# Altium project hardware.PrjPcb
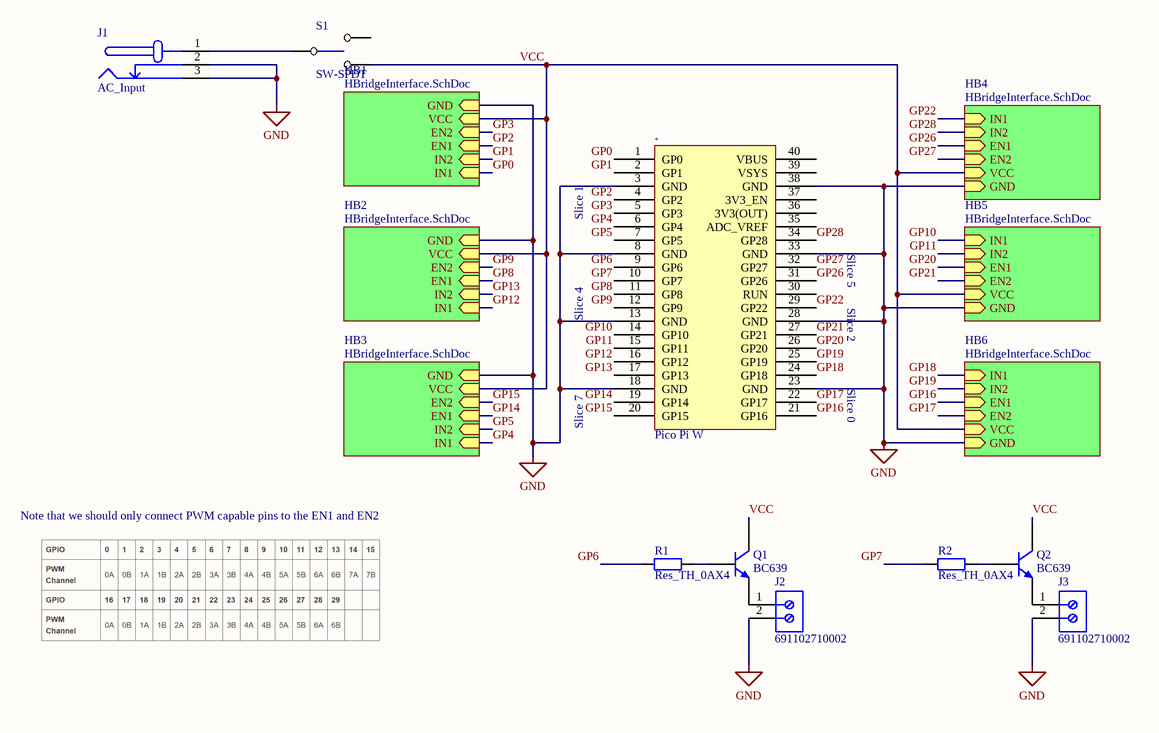
[diagram p0: HardwareSchematic.SchDoc]
3 sheets, 36 parts. Net scope: hierarchical (ports join the sheet entries above them; power ports are global).
Board files: Hardware.PcbDoc, Hardwarev2.PcbDoc
Sheets:
  HardwareSchematic.SchDoc
    HB1 = HBridgeInterface.SchDoc
    HB2 = HBridgeInterface.SchDoc
    HB3 = HBridgeInterface.SchDoc
    HB5 = HBridgeInterface.SchDoc
    HB6 = HBridgeInterface.SchDoc
    HB4 = HBridgeInterface.SchDoc
  HardwareSchematicv2.SchDoc

## Sheet HardwareSchematic.SchDoc
size A4; SheetNumber: 1; SheetTotal: 2

### Parts
(Parts that share a designator on the sheet are numbered #1, #2 ... from top to bottom, then left to right.)
*#1  Pico Pi W  [New footprint 1]
J1  AC_Input  [AC-Socket]
J2  691102710002  [691102710002]
J3  691102710002  [691102710002]
Q1  BC639  [TO-92R]
Q2  BC639  [TO-92R]
R1  Res_TH_0AX4  [AXIAL-0.4]
R2  Res_TH_0AX4  [AXIAL-0.4]
S1  SW-SPDT  [SW-SPDT]

### Sub-sheets
HB1 = HBridgeInterface.SchDoc: IN1 (in), IN2 (in), EN1 (in), EN2 (in), VCC (in), GND (in)
HB2 = HBridgeInterface.SchDoc: IN1 (in), IN2 (in), EN1 (in), EN2 (in), VCC (in), GND (in)
HB3 = HBridgeInterface.SchDoc: IN1 (in), IN2 (in), EN1 (in), EN2 (in), VCC (in), GND (in)
HB4 = HBridgeInterface.SchDoc: IN1 (in), IN2 (in), EN1 (in), EN2 (in), VCC (in), GND (in)
HB5 = HBridgeInterface.SchDoc: IN1 (in), IN2 (in), EN1 (in), EN2 (in), VCC (in), GND (in)
HB6 = HBridgeInterface.SchDoc: IN1 (in), IN2 (in), EN1 (in), EN2 (in), VCC (in), GND (in)

### Nets
GND: *#1.3(GND) *#1.8(GND) *#1.13(GND) *#1.18(GND) *#1.23(GND) *#1.28(GND) *#1.33(GND) *#1.38(GND) J1.2(GND_ALT) J1.3(GND) J2.2 J3.2 ; sheet HB1/GND, sheet HB2/GND, sheet HB3/GND, sheet HB5/GND, sheet HB6/GND, sheet HB4/GND
GP0: *#1.1(GP0) ; sheet HB1/IN1
GP1: *#1.2(GP1) ; sheet HB1/IN2
GP2: *#1.4(GP2) ; sheet HB1/EN1
GP3: *#1.5(GP3) ; sheet HB1/EN2
GP4: *#1.6(GP4) ; sheet HB3/IN1
GP5: *#1.7(GP5) ; sheet HB3/IN2
GP6: *#1.9(GP6) R1.1
GP7: *#1.10(GP7) R2.1
GP8: *#1.11(GP8) ; sheet HB2/EN1
GP9: *#1.12(GP9) ; sheet HB2/EN2
GP10: *#1.14(GP10) ; sheet HB5/IN1
GP11: *#1.15(GP11) ; sheet HB5/IN2
GP12: *#1.16(GP12) ; sheet HB2/IN1
GP13: *#1.17(GP13) ; sheet HB2/IN2
GP14: *#1.19(GP14) ; sheet HB3/EN1
GP15: *#1.20(GP15) ; sheet HB3/EN2
GP16: *#1.21(GP16) ; sheet HB6/EN1
GP17: *#1.22(GP17) ; sheet HB6/EN2
GP18: *#1.24(GP18) ; sheet HB6/IN1
GP19: *#1.25(GP19) ; sheet HB6/IN2
GP20: *#1.26(GP20) ; sheet HB5/EN1
GP21: *#1.27(GP21) ; sheet HB5/EN2
GP22: *#1.29(GP22) ; sheet HB4/IN1
GP26: *#1.31(GP26) ; sheet HB4/EN1
GP27: *#1.32(GP27) ; sheet HB4/EN2
GP28: *#1.34(GP28) ; sheet HB4/IN2
VCC: Q1.2(C) Q2.2(C) S1.3 ; sheet HB1/VCC, sheet HB2/VCC, sheet HB3/VCC, sheet HB5/VCC, sheet HB6/VCC, sheet HB4/VCC
NetJ1_1: J1.1(VCC) S1.2
NetJ2_1: J2.1 Q1.3(E)
NetJ3_1: J3.1 Q2.3(E)
NetQ1_1: Q1.1(B) R1.2
NetQ2_1: Q2.1(B) R2.2

Not connected (* = marked no-connect by the designer): *#1 30(RUN) 35(ADC_VREF) 36(3V3(OUT)) 37(3V3_EN) 39(VSYS) 40(VBUS); S1 1

### Notes on the sheet
- Slice 1
- Slice 5
- Slice 4
- Slice 2
- Slice 7
- Slice 0
- Note that we should only connect PWM capable pins to the EN1 and EN2

### Library data of the parts
*#1 = Pico-Pi-W-1: micro
J1 = CMP-007-000005-1: DC barrel jack connection to AC source; Value: socket; Component Type: Standard; Design Item ID: AC_Input; Source: EE209_SchLib.SchLib; Pin Count: 3
J2 J3 = CMP-1502-03258-2: NexarPartId: 8917706; Number of Levels: 1; Number of Positions Per Level: 2; Current: 15A; Voltage: 300V; Pitch: 5.0038mm; Plating: Steel; Stripping Length: -6mm; Wire Gauge (Min): 14AWG; Wire Gauge (Max): 22AWG; Length: 7.5mm; Contact Material: Brass; Contact Plating: Tin; Packaging: Box; Number of Pins: 2; Voltage Rating: 300V; Termination: Screw; Number of Contacts: 2; Color: Blue; Current Rating: 15A; Mount: Through Hole; Max Operating Temperature: 105°C; Min Operating Temperature: -40°C; REACH SVHC: Unknown; Height: 13.4mm; Width: 11.2mm; Housing Material: Nylon; RoHS: Compliant; Wire/Cable Gauge: 22AWG; Lead Pitch: 5mm
Q1 Q2 = CMP-026-000003-1: High Current Transistor NPN Silicon; PackageDocument: 1996; LatestRevisionDate: 17-Jul-2002; Publisher: Altium Limited; LatestRevisionNote: Re-released for DXP Platform.; Component Type: Standard; Pin Count: 3; PackageReference: 29-04; Source: COMSYS301.SCHLIB; ComponentLink1URL: http://www.motorola.com/; Published: 29-Sep-2000; Design Item ID: BC639; ComponentLink1Description: Manufacturer Link; DatasheetDocument: Nov-1999
R1 R2 = CMP-019-000001-1: Through hole resistor; Source: EE209_SchLib.SchLib; Pin Count: 2; PackageReference: AXIAL-0.4; Design Item ID: Res_TH_0AX4; LatestRevisionDate: 17-Jul-2002; Component Type: Standard; Published: 8-Jun-2000; Value: *; Publisher: Altium Limited; LatestRevisionNote: Re-released for DXP Platform.
S1 = CMP-025-000001-1: Toggle Switch; Source: COMSYS301.SCHLIB; Pin Count: 3; Component Type: Standard; Design Item ID: SW-SPDT

## Sheet HBridgeInterface.SchDoc
size A4; SheetNumber: 2; SheetTotal: 2
Used 6 times, as channels HB1, HB2, HB3, HB5, HB6, HB4. Parts and nets are listed once, with the designators drawn on the sheet.
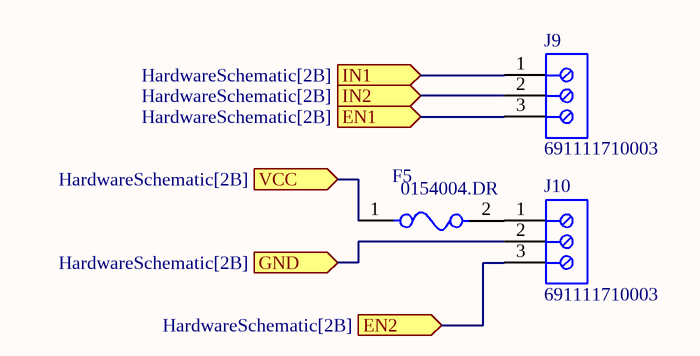
[diagram p1: HBridgeInterface.SchDoc]

### Parts
F5  0154004.DR  [FP-0154-MFG]
J9  691111710003  [691111710003]
J10  691111710003  [691111710003]

### Ports
EN1 (in, see HardwareSchematic[2B]), EN2 (in, see HardwareSchematic[2B]), GND (in, see HardwareSchematic[2B]), IN1 (in, see HardwareSchematic[2B]), IN2 (in, see HardwareSchematic[2B]), VCC (in, see HardwareSchematic[2B])

### Nets
EN1: J9.3 ; port EN1
EN2: J10.3 ; port EN2
GND: J10.2 ; port GND
IN1: J9.1 ; port IN1
IN2: J9.2 ; port IN2
VCC: F5.1 ; port VCC
NetF5_2: F5.2 J10.1

### Channels
HB1: designators end in _HB1; ports EN1=GP2 EN2=GP3 GND=GND IN1=GP0 IN2=GP1 VCC=VCC
HB2: designators end in _HB2; ports EN1=GP8 EN2=GP9 GND=GND IN1=GP12 IN2=GP13 VCC=VCC
HB3: designators end in _HB3; ports EN1=GP14 EN2=GP15 GND=GND IN1=GP4 IN2=GP5 VCC=VCC
HB5: designators end in _HB5; ports EN1=GP20 EN2=GP21 GND=GND IN1=GP10 IN2=GP11 VCC=VCC
HB6: designators end in _HB6; ports EN1=GP16 EN2=GP17 GND=GND IN1=GP18 IN2=GP19 VCC=VCC
HB4: designators end in _HB4; ports EN1=GP26 EN2=GP27 GND=GND IN1=GP22 IN2=GP28 VCC=VCC

### Library data of the parts
F5 = CMP-08605-000003-1: FUSE BRD MNT 4A 125VAC/VDC 2SMD; Manufacturer: Littelfuse; Fuse Blow Speed: Fast; Max Fuse Ac Voltage: 125V; Lead Free: Yes; Device Class L3: unset; Manufacturer Part Number: 0154004.DR; Device Class L2: Fuses; Package: 0154; ComponentLink2Description: Datasheet; Temperature Range Low: -55°C; Temperature Range High: +125°C; Device Class L1: Circuit Protection; Height: 3.81mm; Temperature: -55°C to +125°C; Mouser Description: Surface Mount Fuses Fuseblock w/ fuse 4A OMNI BLOK 154; Automotive: No; Digikey Description: FUSE BRD MNT 4A 125VAC/VDC 2SMD; RoHS: TRUE; Category: Fuse; Fuse Current: 4A; Max Fuse Dc Voltage: 125V; ComponentLink2URL: https://www.littelfuse.com/~/media/electronics/datasheets/fuses/littelfuse_fuse_154_154t_154l_154tl_datasheet.pdf.pdf; Octopart: https://octopart.com/0154004.dr-littelfuse-565861
J9 J10 = CMP-1502-03263-2: NexarPartId: 8917709; Wire/Cable Gauge: 26AWG; Wire Gauge (Min): 14AWG; Plating: Steel; Pitch: 5.0038mm; Current: 8A; Number of Positions Per Level: 3; Number of Levels: 1; Voltage Rating: 300V; Stripping Length: -6mm; Length: 7.6mm; Lead Pitch: 5mm; Color: Green; Termination: Screw; Wire Gauge (Max): 26AWG; Max Operating Temperature: 105°C; RoHS: Compliant; Width: 16.2mm; REACH SVHC: Unknown; Current Rating: 8A; Packaging: Box; Contact Material: Brass; Contact Plating: Tin; Number of Contacts: 3; Voltage: 300V; Height: 14mm; Number of Pins: 3; Mount: Through Hole; Min Operating Temperature: -40°C; Housing Material: Nylon

## Sheet HardwareSchematicv2.SchDoc
size A4; SheetNumber: 3; SheetTotal: 3
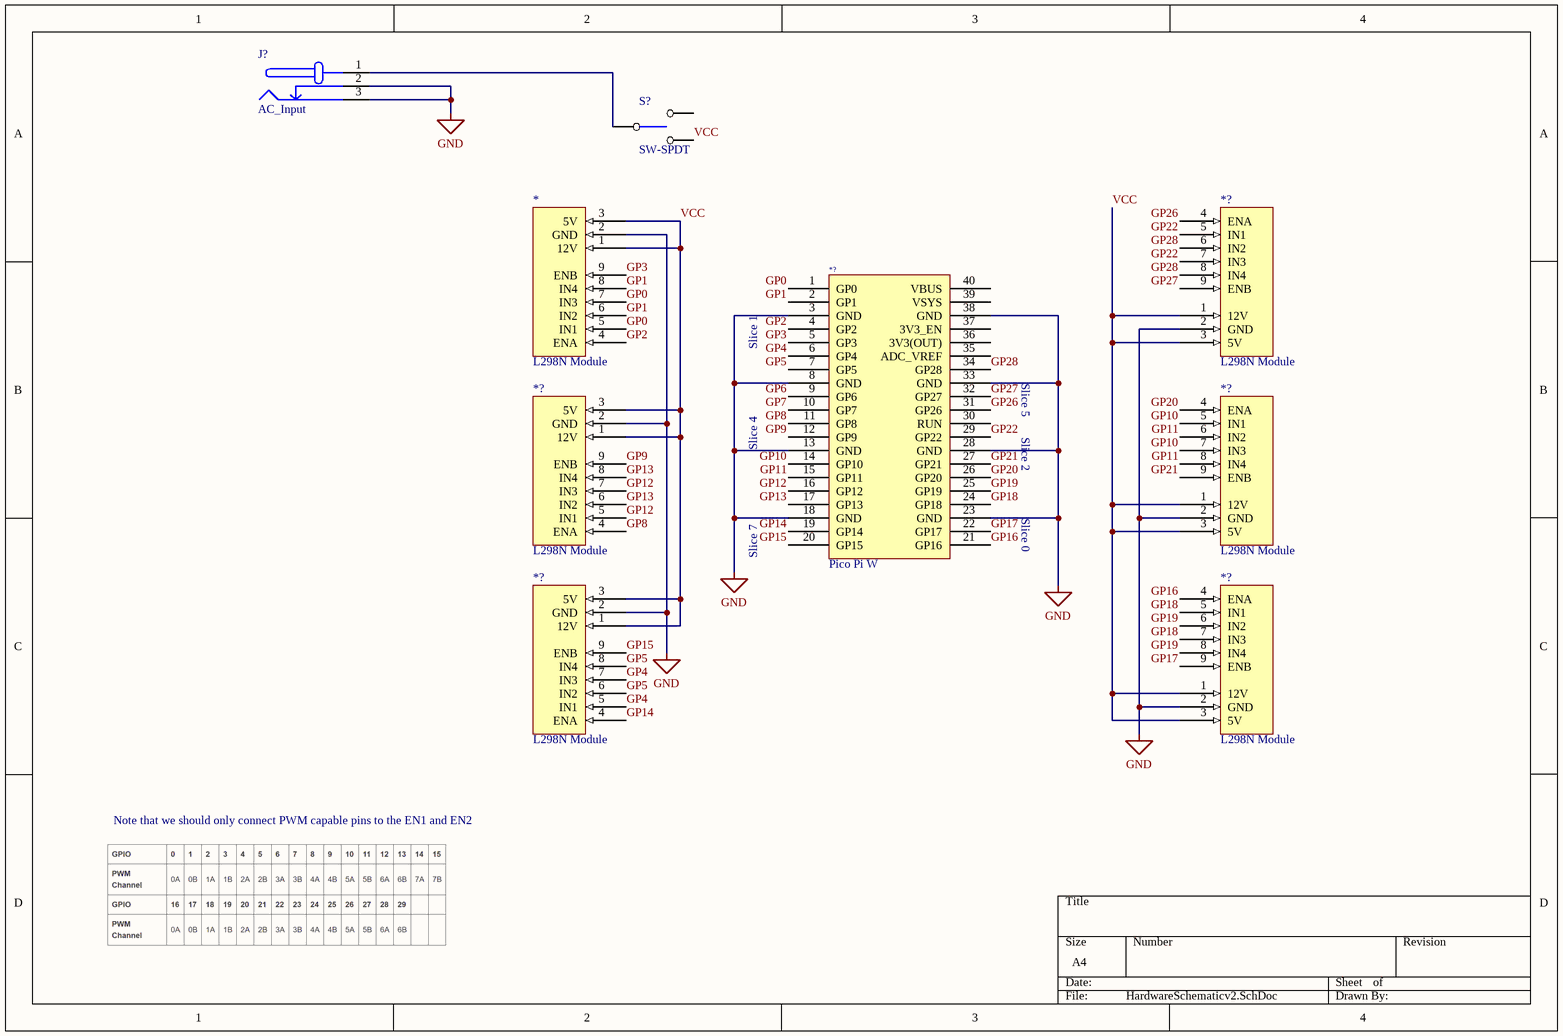
[diagram p2: HardwareSchematicv2.SchDoc]

### Parts
(Parts that share a designator on the sheet are numbered #1, #2 ... from top to bottom, then left to right.)
*#2  L298N Module  [New footprint 1]
*?#1  L298N Module  [New footprint 1]
*?#2  Pico Pi W  [New footprint 1]
*?#3  L298N Module  [New footprint 1]
*?#4  L298N Module  [New footprint 1]
*?#5  L298N Module  [New footprint 1]
*?#6  L298N Module  [New footprint 1]
J?  AC_Input  [AC-Socket]
S?  SW-SPDT  [SW-SPDT]

### Nets
GND: *#2.2(GND) *?#1.2(GND) *?#2.3(GND) *?#2.8(GND) *?#2.13(GND) *?#2.18(GND) *?#2.23(GND) *?#2.28(GND) *?#2.33(GND) *?#2.38(GND) *?#3.2(GND) *?#4.2(GND) *?#5.2(GND) *?#6.2(GND) J?.2(GND_ALT) J?.3(GND)
GP0: *#2.5(IN1) *#2.7(IN3) *?#2.1(GP0)
GP1: *#2.6(IN2) *#2.8(IN4) *?#2.2(GP1)
GP2: *#2.4(ENA) *?#2.4(GP2)
GP3: *#2.9(ENB) *?#2.5(GP3)
GP4: *?#2.6(GP4) *?#6.5(IN1) *?#6.7(IN3)
GP5: *?#2.7(GP5) *?#6.6(IN2) *?#6.8(IN4)
GP6: *?#2.9(GP6)
GP7: *?#2.10(GP7)
GP8: *?#2.11(GP8) *?#4.4(ENA)
GP9: *?#2.12(GP9) *?#4.9(ENB)
GP10: *?#2.14(GP10) *?#3.5(IN1) *?#3.7(IN3)
GP11: *?#2.15(GP11) *?#3.6(IN2) *?#3.8(IN4)
GP12: *?#2.16(GP12) *?#4.5(IN1) *?#4.7(IN3)
GP13: *?#2.17(GP13) *?#4.6(IN2) *?#4.8(IN4)
GP14: *?#2.19(GP14) *?#6.4(ENA)
GP15: *?#2.20(GP15) *?#6.9(ENB)
GP16: *?#2.21(GP16) *?#5.4(ENA)
GP17: *?#2.22(GP17) *?#5.9(ENB)
GP18: *?#2.24(GP18) *?#5.5(IN1) *?#5.7(IN3)
GP19: *?#2.25(GP19) *?#5.6(IN2) *?#5.8(IN4)
GP20: *?#2.26(GP20) *?#3.4(ENA)
GP21: *?#2.27(GP21) *?#3.9(ENB)
GP22: *?#1.5(IN1) *?#1.7(IN3) *?#2.29(GP22)
GP26: *?#1.4(ENA) *?#2.31(GP26)
GP27: *?#1.9(ENB) *?#2.32(GP27)
GP28: *?#1.6(IN2) *?#1.8(IN4) *?#2.34(GP28)
VCC: *#2.1(12V) *#2.3(5V) *?#1.1(12V) *?#1.3(5V) *?#3.1(12V) *?#3.3(5V) *?#4.1(12V) *?#4.3(5V) *?#5.1(12V) *?#5.3(5V) *?#6.1(12V) *?#6.3(5V) S?.3
NetJ?_1: J?.1(VCC) S?.2

Not connected (* = marked no-connect by the designer): *?#2 30(RUN) 35(ADC_VREF) 36(3V3(OUT)) 37(3V3_EN) 39(VSYS) 40(VBUS); S? 1

### Notes on the sheet
- Slice 1
- Slice 5
- Slice 4
- Slice 2
- Slice 0
- Slice 7
- Note that we should only connect PWM capable pins to the EN1 and EN2

### Library data of the parts
*#2 *?#1 *?#3-*?#6 = L298N_Board-1: Direct conector for H-Bridge
*?#2 = Pico-Pi-W-1: micro
J? = CMP-007-000005-1: as J1 on sheet HardwareSchematic; Component Type: Standard; Design Item ID: AC_Input; Source: EE209_SchLib.SchLib; Pin Count: 3
S? = CMP-025-000001-1: Toggle Switch; Source: COMSYS301.SCHLIB; Pin Count: 3; Component Type: Standard; Design Item ID: SW-SPDT

## Nets that join several sheets
GND: HardwareSchematic (12 pins), HB1 (J10_HB1.2), HB2 (J10_HB2.2), HB3 (J10_HB3.2), HB5 (J10_HB5.2), HB6 (J10_HB6.2), HB4 (J10_HB4.2), HardwareSchematicv2 (16 pins)
GP0: HardwareSchematic (*#1.1), HB1 (J9_HB1.1)
GP1: HardwareSchematic (*#1.2), HB1 (J9_HB1.2)
GP2: HardwareSchematic (*#1.4), HB1 (J9_HB1.3)
GP3: HardwareSchematic (*#1.5), HB1 (J10_HB1.3)
GP4: HardwareSchematic (*#1.6), HB3 (J9_HB3.1)
GP5: HardwareSchematic (*#1.7), HB3 (J9_HB3.2)
GP8: HardwareSchematic (*#1.11), HB2 (J9_HB2.3)
GP9: HardwareSchematic (*#1.12), HB2 (J10_HB2.3)
GP10: HardwareSchematic (*#1.14), HB5 (J9_HB5.1)
GP11: HardwareSchematic (*#1.15), HB5 (J9_HB5.2)
GP12: HardwareSchematic (*#1.16), HB2 (J9_HB2.1)
GP13: HardwareSchematic (*#1.17), HB2 (J9_HB2.2)
GP14: HardwareSchematic (*#1.19), HB3 (J9_HB3.3)
GP15: HardwareSchematic (*#1.20), HB3 (J10_HB3.3)
GP16: HardwareSchematic (*#1.21), HB6 (J9_HB6.3)
GP17: HardwareSchematic (*#1.22), HB6 (J10_HB6.3)
GP18: HardwareSchematic (*#1.24), HB6 (J9_HB6.1)
GP19: HardwareSchematic (*#1.25), HB6 (J9_HB6.2)
GP20: HardwareSchematic (*#1.26), HB5 (J9_HB5.3)
GP21: HardwareSchematic (*#1.27), HB5 (J10_HB5.3)
GP22: HardwareSchematic (*#1.29), HB4 (J9_HB4.1)
GP26: HardwareSchematic (*#1.31), HB4 (J9_HB4.3)
GP27: HardwareSchematic (*#1.32), HB4 (J10_HB4.3)
GP28: HardwareSchematic (*#1.34), HB4 (J9_HB4.2)
VCC: HardwareSchematic (Q1.2 Q2.2 S1.3), HB1 (F5_HB1.1), HB2 (F5_HB2.1), HB3 (F5_HB3.1), HB5 (F5_HB5.1), HB6 (F5_HB6.1), HB4 (F5_HB4.1)